# Altium schematic sheet s01_soc.SchDoc
size A4
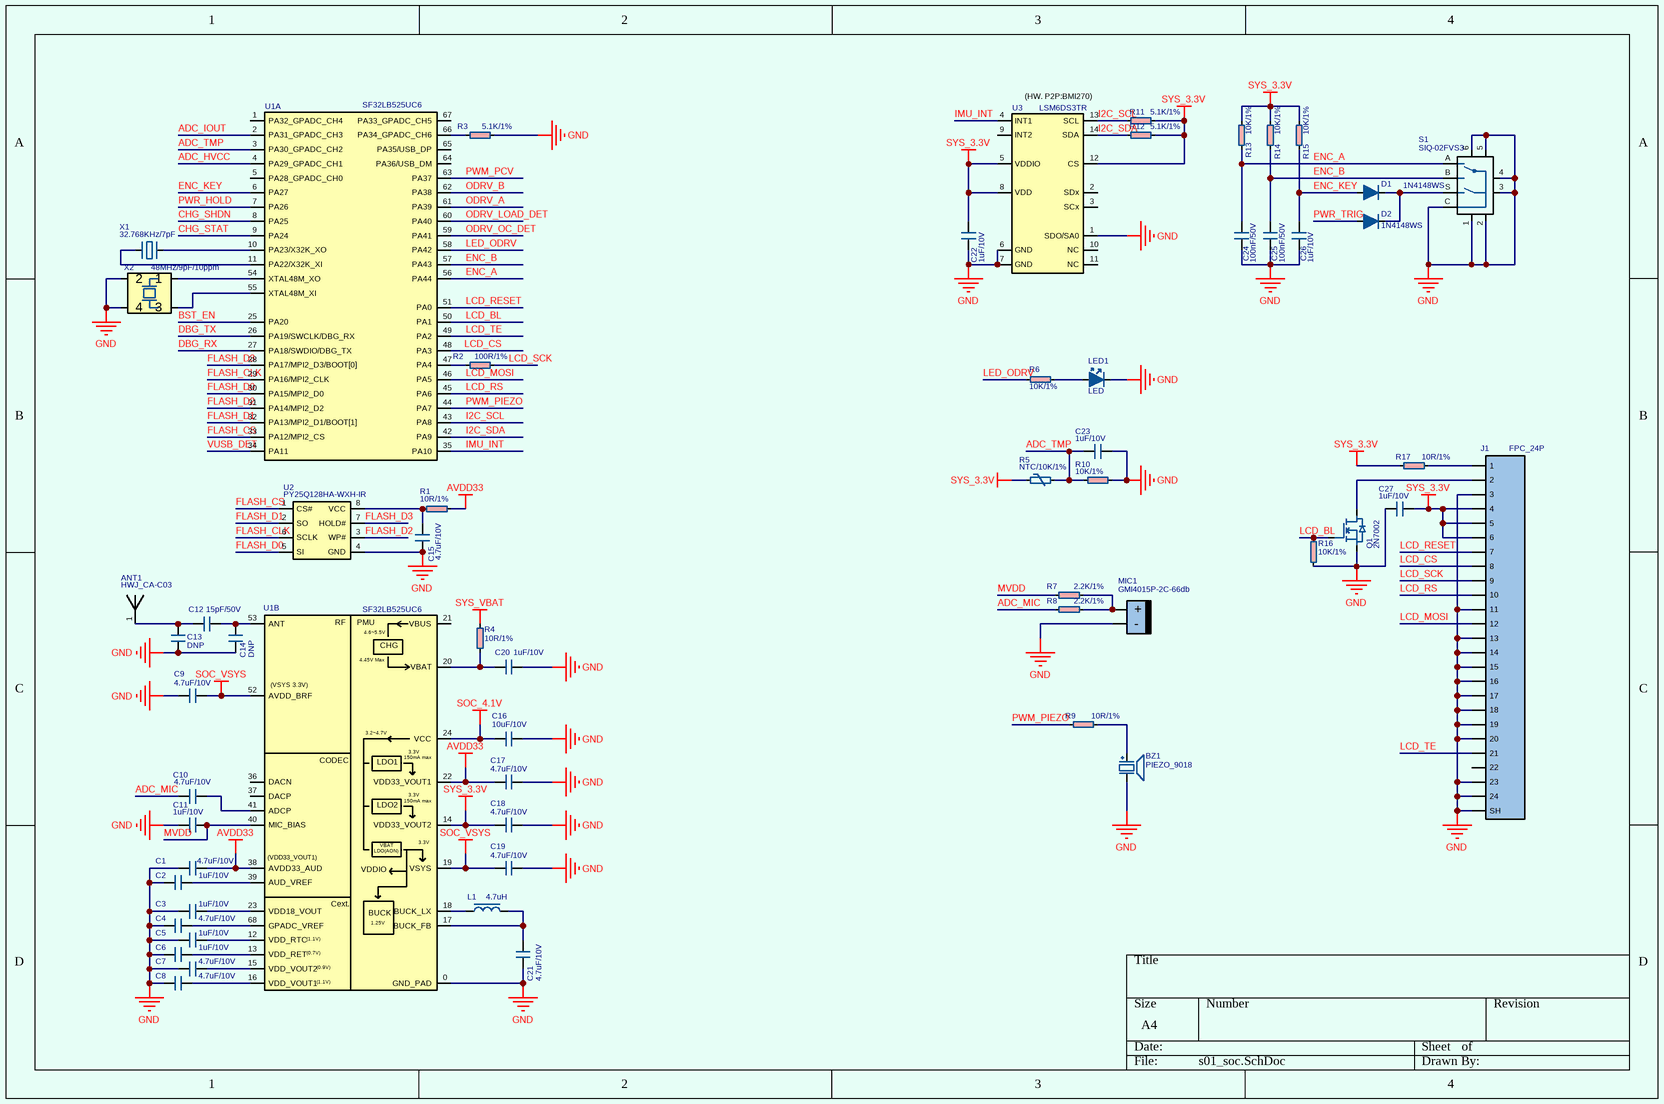
[diagram p0: s01_soc.SchDoc]

## Parts
ANT1  HWJ_CA-C03  [ANT_2.4G_HWJ_CA-C03_MIRROR_OUTLINE]
BZ1  PIEZO_9018  [BUZZER_PIEZO_SMD_9X9X1.8MM_2PIN]
C1  4.7uF/10V  [0402C]
C2  1uF/10V  [0402C]
C3  1uF/10V  [0402C]
C4  4.7uF/10V  [0402C]
C5  1uF/10V  [0402C]
C6  1uF/10V  [0402C]
C7  4.7uF/10V  [0402C]
C8  4.7uF/10V  [0402C]
C9  4.7uF/10V  [0402C]
C10  4.7uF/10V  [0402C]
C11  1uF/10V  [0402C]
C12  15pF/50V  [0402C]
C13  DNP  [0402C]
C14  DNP  [0402C]
C15  4.7uF/10V  [0402C]
C16  10uF/10V  [0603C]
C17  4.7uF/10V  [0402C]
C18  4.7uF/10V  [0402C]
C19  4.7uF/10V  [0402C]
C20  1uF/10V  [0402C]
C21  4.7uF/10V  [0402C]
C22  1uF/10V  [0402C]
C23  1uF/10V  [0402C]
C24  100nF/50V  [0402C]
C25  100nF/50V  [0402C]
C26  1uF/10V  [0402C]
C27  1uF/10V  [0402C]
D1  1N4148WS  [SOD323]
D2  1N4148WS  [SOD323]
J1  FPC_24P  [FPC_0.5MM_24P_H1.0_DNUP_MIRROR_FH34SRJ-24S-0.5SH]
L1  4.7uH  [INDUCTOR_0806_HD]
LED1  LED  [LED_0603]
MIC1  GMI4015P-2C-66db  [MIC_DIP_F4_H1.5]
Q1  2N7002  [SOT23_MOS]
R1  10R/1%  [0402R]
R2  100R/1%  [0402R]
R3  5.1K/1%  [0402R]
R4  10R/1%  [0402R]
R5  NTC/10K/1%  [0402R]
R6  10K/1%  [0402R]
R7  2.2K/1%  [0402R]
R8  2.2K/1%  [0402R]
R9  10R/1%  [0603R]
R10  10K/1%  [0402R]
R11  5.1K/1%  [0402R]
R12  5.1K/1%  [0402R]
R13  10K/1%  [0402R]
R14  10K/1%  [0402R]
R15  10K/1%  [0402R]
R16  10K/1%  [0402R]
R17  10R/1%  [0402R]
S1  SIQ-02FVS3  [ENCODER_SMD_SIQ_02FVS3]
U1  SF32LB525UC6  [QFN68_0.35_7X7_H0.9]  (parts A,B of 2)
U2  PY25Q128HA-WXH-IR  [DFN_5X6_1.27_EPAD_FLASH]
U3  LSM6DS3TR  [LGA14_0.5_2.5X3_H0.9]
X1  32.768KHz/7pF  [XTAL_3215_2P]
X2  48MHz/9pF/10ppm  [XTAL_2016_4P_N]

## Nets
AVDD33: C1.2 C17.1 R1.1 U1.22(VDD33_VOUT1) U1.38(AVDD33_AUD)
GND: BZ1.2 C1.1 C2.1 C3.1 C4.1 C5.1 C6.1 C7.1 C8.1 C9.1 C11.1 C13.2 C14.1 C15.1 C16.1 C17.2 C18.2 C19.2 C20.1 C21.1 C22.1 C23.1 C24.1 C25.1 C26.1 C27.1 J1.0(SH) J1.3 J1.11 J1.13 J1.14 J1.15 J1.16 J1.17 J1.18 J1.19 J1.20 J1.23 J1.24 LED1.2 MIC1.2(-) Q1.S R3.2 R10.1 R16.2 S1.1 S1.2 S1.3 S1.4 S1.5 S1.6 S1.C U1.0(GND_PAD) U2.4(GND) U3.1(SDO/SA0) U3.6(GND) U3.7(GND) X2.2 X2.4
SOC_4.1V: C16.2 U1.24(VCC)
SOC_VSYS: C9.2 C19.1 U1.19(VSYS) U1.52(AVDD_BRF)
SYS_3.3V: C18.1 C22.2 C27.2 J1.4 J1.5 J1.6 R5.1 R11.1 R12.1 R13.2 R14.2 R15.2 R17.1 U1.14(VDD33_VOUT2) U3.5(VDDIO) U3.8(VDD) U3.12(CS)
SYS_VBAT: R4.1
ADC_HVCC: U1.4(PA29_GPADC_CH1)
ADC_IOUT: U1.2(PA31_GPADC_CH3)
ADC_MIC: C10.1 R8.2
ADC_TMP: C23.2 R5.2 R10.2 U1.3(PA30_GPADC_CH2)
BST_EN: U1.25(PA20)
CHG_SHDN: U1.8(PA25)
CHG_STAT: U1.9(PA24)
DBG_RX: U1.27(PA18/SWDIO/DBG_TX)
DBG_TX: U1.26(PA19/SWCLK/DBG_RX)
ENC_A: C24.2 R13.1 S1.A U1.56(PA44)
ENC_B: C25.2 R14.1 S1.B U1.57(PA43)
ENC_KEY: C26.2 D1.1 R15.1 U1.6(PA27)
FLASH_CLK: U1.29(PA16/MPI2_CLK) U2.6(SCLK)
FLASH_CS: U1.33(PA12/MPI2_CS) U2.1(CS#)
FLASH_D0: U1.30(PA15/MPI2_D0) U2.5(SI)
FLASH_D1: U1.32(PA13/MPI2_D1/BOOT[1]) U2.2(SO)
FLASH_D2: U1.31(PA14/MPI2_D2) U2.3(WP#)
FLASH_D3: U1.28(PA17/MPI2_D3/BOOT[0]) U2.7(HOLD#)
I2C_SCL: R11.2 U1.43(PA8) U3.13(SCL)
I2C_SDA: R12.2 U1.42(PA9) U3.14(SDA)
IMU_INT: U1.35(PA10) U3.4(INT1)
LCD_BL: Q1.G R16.1 U1.50(PA1)
LCD_CS: J1.8 U1.48(PA3)
LCD_MOSI: J1.12 U1.46(PA5)
LCD_RESET: J1.7 U1.51(PA0)
LCD_RS: J1.10 U1.45(PA6)
LCD_SCK: J1.9 R2.2
LCD_TE: J1.21 U1.49(PA2)
LED_ODRV: R6.2 U1.58(PA42)
MVDD: C11.2 R7.2 U1.40(MIC_BIAS)
ODRV_A: U1.61(PA39)
ODRV_B: U1.62(PA38)
ODRV_LOAD_DET: U1.60(PA40)
ODRV_OC_DET: U1.59(PA41)
PWM_PCV: U1.63(PA37)
PWM_PIEZO: R9.1 U1.44(PA7)
PWR_HOLD: U1.7(PA26)
PWR_TRIG: D2.1
VUSB_DET: U1.34(PA11)
NetANT1_1: ANT1.1(ANT) C12.2 C13.1
NetBZ1_1: BZ1.1 R9.2
NetC2_2: C2.2 U1.39(AUD_VREF)
NetC3_2: C3.2 U1.23(VDD18_VOUT)
NetC4_2: C4.2 U1.68(GPADC_VREF)
NetC5_2: C5.2 U1.12(VDD_RTC)
NetC6_2: C6.2 U1.13(VDD_RET)
NetC7_2: C7.2 U1.15(VDD_VOUT2)
NetC8_2: C8.2 U1.16(VDD_VOUT1)
NetC10_2: C10.2 U1.41(ADCP)
NetC12_1: C12.1 C14.2 U1.53(ANT)
NetC15_2: C15.2 R1.2 U2.8(VCC)
NetC20_2: C20.2 R4.2 U1.20(VBAT)
NetC21_2: C21.2 L1.2 U1.17(BUCK_FB)
NetD1_2: D1.2 D2.2 S1.S
NetJ1_1: J1.1 R17.2
NetJ1_2: J1.2 Q1.D
NetL1_1: L1.1 U1.18(BUCK_LX)
NetLED1_1: LED1.1 R6.1
NetMIC1_1: MIC1.1(+) R7.1 R8.1
NetR2_1: R2.1 U1.47(PA4)
NetR3_1: R3.1 U1.66(PA34_GPADC_CH6)
NetU1_10: U1.10(PA23/X32K_XO) X1.2
NetU1_11: U1.11(PA22/X32K_XI) X1.1
NetU1_54: U1.54(XTAL48M_XO) X2.1
NetU1_55: U1.55(XTAL48M_XI) X2.3

Not connected (* = marked no-connect by the designer): J1 22; U1 1(PA32_GPADC_CH4) 5(PA28_GPADC_CH0) 21(VBUS) 36(DACN) 37(DACP) 64(PA36/USB_DM) 65(PA35/USB_DP) 67(PA33_GPADC_CH5); U3 2(SDx) 3(SCx) 9(INT2) 10(NC) 11(NC)

## Notes on the sheet
- (near U3) (HW. P2P:BMI270)
- (in symbol SOC_SIFLI_SF32LB525UC6, part B) RF; PMU; 4.6~5.5V; CHG; 4.45V Max; (VSYS 3.3V); 3.2~4.7V; 3.3V; 150mA max; CODEC; LDO1; LDO2; LDO(AON); (VDD33_VOUT1); VDDIO; Cext.; BUCK; 1.25V; (1.1V); (0.7V); (0.9V)

## Library data of the parts
ANT1 = ANT_2.4G_HWJ_CA-C03: T-net: 0R-3nH-0R
BZ1 = BUZZER_PIEZO_2PIN
C1-C27 = CAP
D1 D2 = VD
J1 = CON24_FPC
L1 = INDUCTOR
LED1 = LED_GENERAL
MIC1 = MIC_ELE
Q1 = MOS_N
R1-R4 R6-R17 = RES
R5 = NTC
S1 = ENCODER_SIQ-02FVS3: Rotary encoder in 15 detents with push function
U1 = SOC_SIFLI_SF32LB525UC6: Li-ion power, 8MB psram, VSYS connect to VBAT
U2 = GD25Q32
U3 = LSM6DS3: always-on 3D accelerometer and 3D gyroscope
X1 = XTAL: Q13FC13500002
X2 = XTAL_SMT_PASSIVE4PIN: SX20Y048000B91T004